# EAGLE design Arduino_uno_plus_EthernetShield_withExptenderPCF8574 (EAGLE 7.6.0)
Schematic for ARDUINO UNO with Eternet shield and Extender PCF8574N
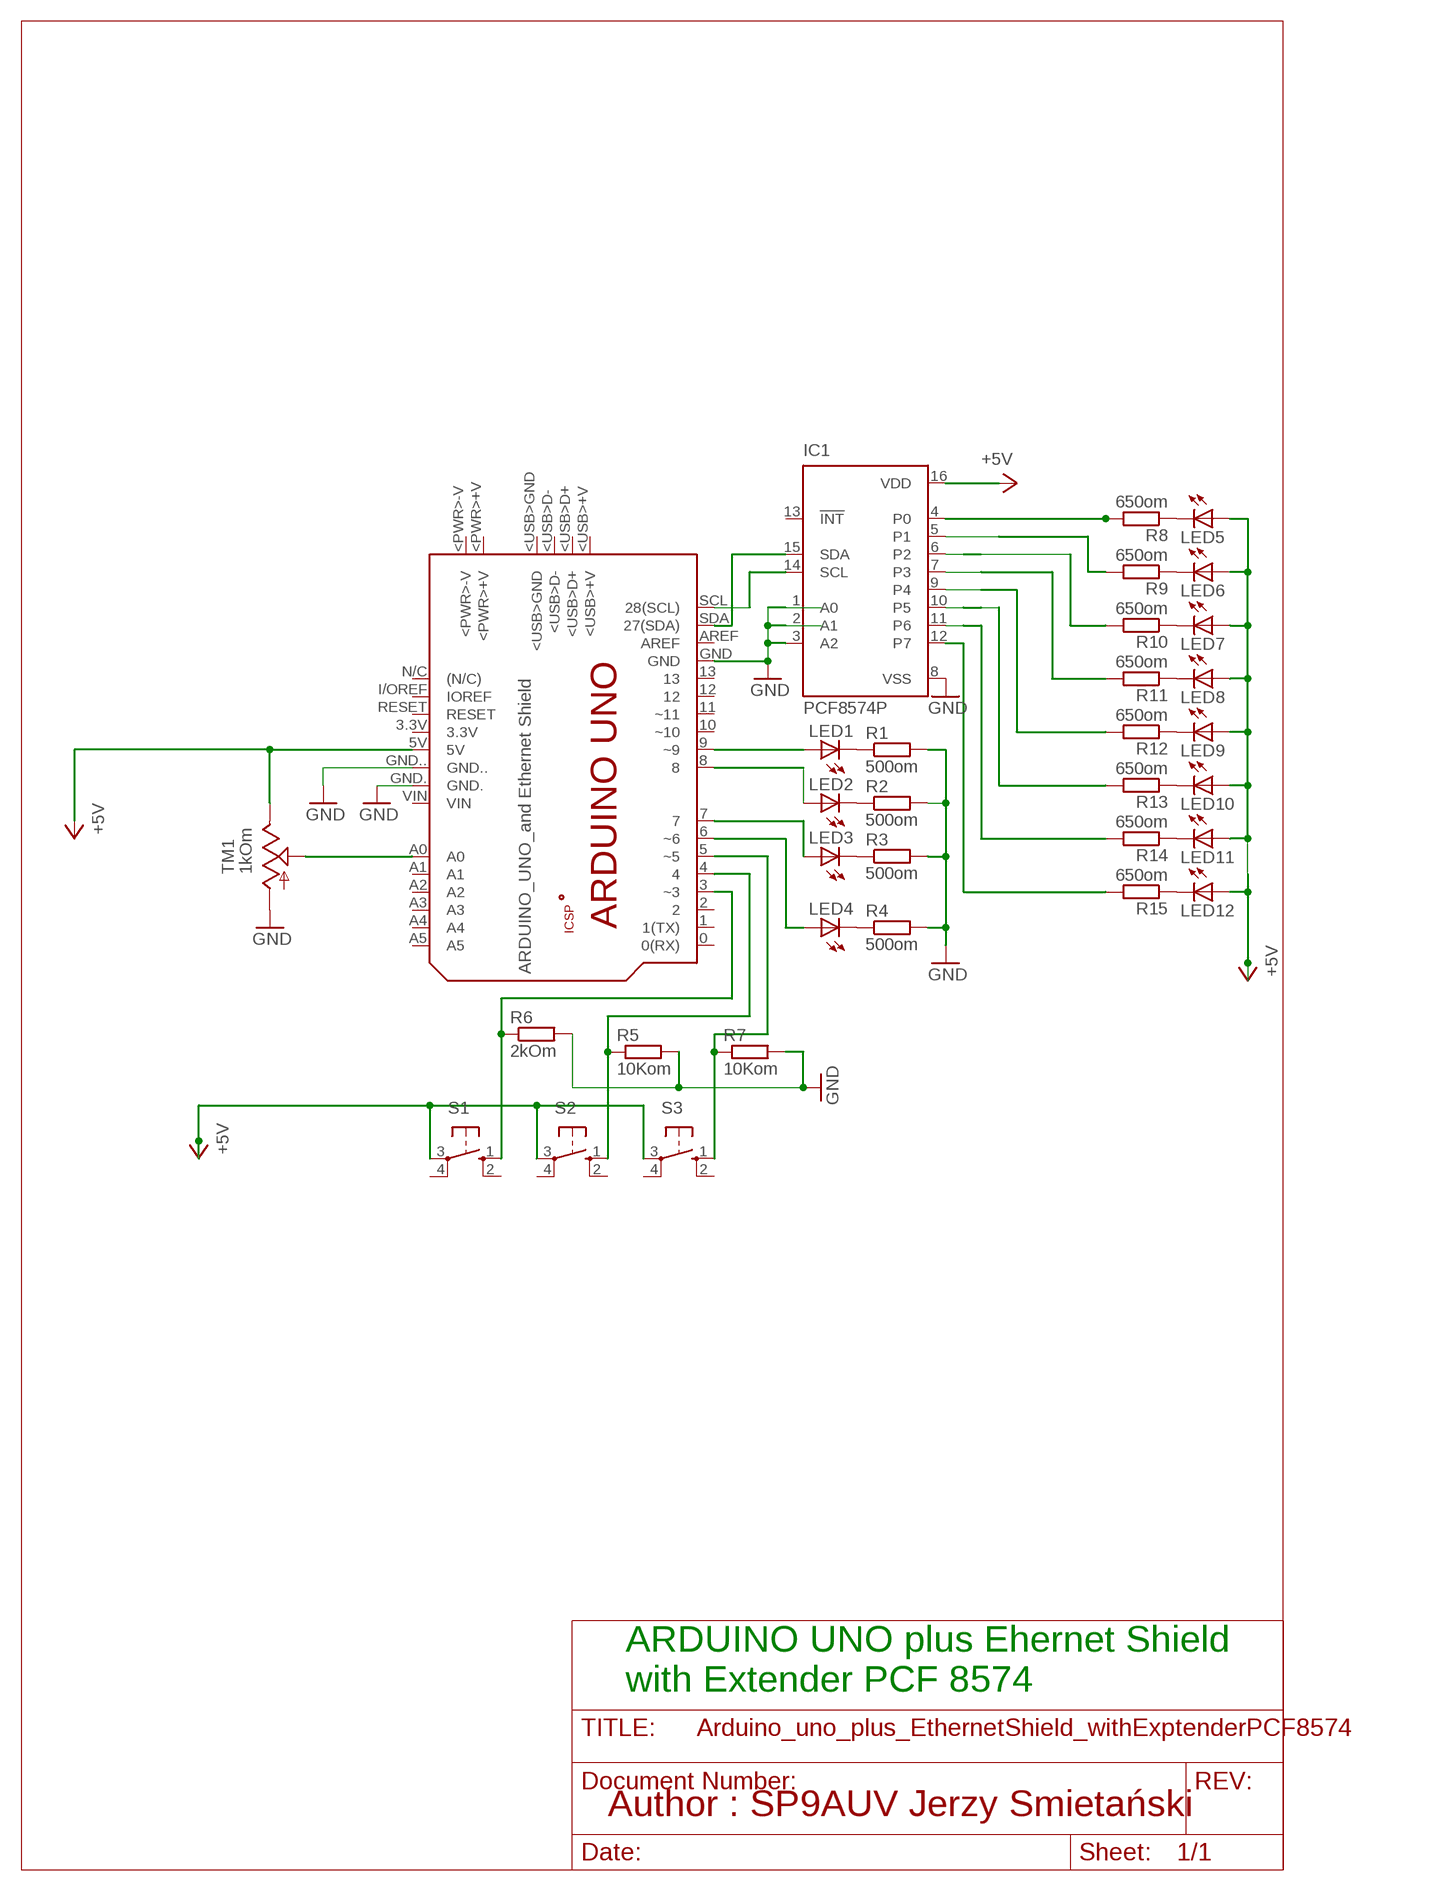
[diagram p0: schematic, sheet 1]

## Parts
ARDUINO_UNO  ARDUINO_U1  ARDUINO_UNO  [ARDUINO_UNO]
IC1  PCF8574P  [DIL16]
LED1  LEDSQR2X5  [LED2X5]
LED2  LEDSQR2X5  [LED2X5]
LED3  LEDSQR2X5  [LED2X5]
LED4  LEDSQR2X5  [LED2X5]
LED5  LEDSQR2X5  [LED2X5]
LED6  LEDSQR2X5  [LED2X5]
LED7  LEDSQR2X5  [LED2X5]
LED8  LEDSQR2X5  [LED2X5]
LED9  LEDSQR2X5  [LED2X5]
LED10  LEDSQR2X5  [LED2X5]
LED11  LEDSQR2X5  [LED2X5]
LED12  LEDSQR2X5  [LED2X5]
R1  500om  R-EU_0204/5  [0204/5]
R2  500om  R-EU_0204/5  [0204/5]
R3  500om  R-EU_0204/5  [0204/5]
R4  500om  R-EU_0204/5  [0204/5]
R5  10Kom  R-EU_0204/5  [0204/5]
R6  2kOm  R-EU_0204/5  [0204/5]
R7  10Kom  R-EU_0204/5  [0204/5]
R8  650om  R-EU_0204/5  [0204/5]
R9  650om  R-EU_0204/5  [0204/5]
R10  650om  R-EU_0204/5  [0204/5]
R11  650om  R-EU_0204/5  [0204/5]
R12  650om  R-EU_0204/5  [0204/5]
R13  650om  R-EU_0204/5  [0204/5]
R14  650om  R-EU_0204/5  [0204/5]
R15  650om  R-EU_0204/5  [0204/5]
S1  10-XX  [B3F-10XX]
S2  10-XX  [B3F-10XX]
S3  10-XX  [B3F-10XX]
TM1  1kOm  TRIM  [6MM]

## Nets
+5V: ARDUINO_UNO.5V IC1.16(VDD) LED5.A LED6.A LED7.A LED8.A LED9.A LED10.A LED11.A LED12.A S1.3(P) S2.3(P) S3.3(P) TM1.E
GND: ARDUINO_UNO.GND ARDUINO_UNO.GND.. IC1.2(A1) IC1.3(A2) IC1.8(VSS) R1.2 R2.2 R3.2 R4.2 R5.2 R6.2 R7.2
GND1: IC1.5(P1) R9.2
N$1: ARDUINO_UNO.A0 TM1.S
N$3: ARDUINO_UNO.GND. TM1.A ; supply symbol labelled GND
N$4: LED1.K(C) R1.1
N$5: LED2.K(C) R2.1
N$6: LED3.K(C) R3.1
N$7: LED4.K(C) R4.1
N$8: ARDUINO_UNO.9(~9) LED1.A
N$9: ARDUINO_UNO.8 LED2.A
N$10: ARDUINO_UNO.7 LED3.A
N$11: ARDUINO_UNO.3(~3) R6.1 S1.1(S)
N$12: ARDUINO_UNO.6(~6) LED4.A
N$13: ARDUINO_UNO.5(~5) R7.1 S3.1(S)
N$14: IC1.1(A0)
N$15: ARDUINO_UNO.4 R5.1 S2.1(S)
N$16: IC1.12(P7) R15.2
N$17: IC1.7(P3) R11.2
N$18: IC1.6(P2) R10.2
N$19: IC1.4(P0) R8.2
N$21: LED5.K(C) R8.1
N$22: LED6.K(C) R9.1
N$23: LED7.K(C) R10.1
N$24: LED8.K(C) R11.1
N$25: IC1.10(P5) R13.2
N$26: IC1.9(P4) R12.2
N$27: ARDUINO_UNO.SCL(28(SCL)) IC1.14(SCL)
N$28: ARDUINO_UNO.SDA(27(SDA)) IC1.15(SDA)
N$29: LED9.K(C) R12.1
N$32: LED10.K(C) R13.1
N$35: LED11.K(C) R14.1
N$36: IC1.11(P6) R14.2
N$38: LED12.K(C) R15.1
Unconnected: ARDUINO_UNO.0(0(RX)) ARDUINO_UNO.1(1(TX)) ARDUINO_UNO.2 ARDUINO_UNO.3.3V ARDUINO_UNO.10(~10) ARDUINO_UNO.11(~11) ARDUINO_UNO.12 ARDUINO_UNO.13 ARDUINO_UNO.+5V ARDUINO_UNO.<PWR>+V ARDUINO_UNO.<PWR>-V ARDUINO_UNO.<USB>+V ARDUINO_UNO.<USB>D+ ARDUINO_UNO.<USB>D- ARDUINO_UNO.<USB>GND ARDUINO_UNO.A1 ARDUINO_UNO.A2 ARDUINO_UNO.A3 ARDUINO_UNO.A4 ARDUINO_UNO.A5 ARDUINO_UNO.AREF ARDUINO_UNO.GND_ ARDUINO_UNO.I/OREF(IOREF) ARDUINO_UNO.MISO ARDUINO_UNO.MOSI ARDUINO_UNO.N/C((N/C)) ARDUINO_UNO.RESET ARDUINO_UNO.RESET. ARDUINO_UNO.SCK ARDUINO_UNO.VIN IC1.13(!INT) S1.2(S1) S1.4(P1) S2.2(S1) S2.4(P1) S3.2(S1) S3.4(P1)

## Notes on the sheet
- ARDUINO UNO plus Ehernet Shield 
  with Extender PCF 8574
- Author : SP9AUV Jerzy Smietański

## Library data of the parts
ARDUINO_UNO = E14_Arduino_revC:ARDUINO_UNO: Device for representing an Arduino Uno board with a footprint in an EAGLE design. Created by Dave Young for Element14. More EAGLE documentation at: http://www.element14.com/community/community/knode/cadsoft_eagle; ARDUINO_UNO_AND_ETHERNET: ARDUINO_UNO_and Ethernet Shield
IC1 = micro-philips:PCF8574: I2C-Bus Remote 8-bit I/O expander http://www.semiconductors.philips.com/acrobat_download/datasheets/PCF8574_4.pdf
LED1-LED12 = led:LED: LED OSRAM: - CHIPLED LG R971, LG N971, LY N971, LG Q971, LY Q971, LO R971, LY R971 LH N974, LH R974 LS Q976, LO Q976, LY Q976 LO Q996 - Hyper CHIPLED LW Q18S LB Q993, LB Q99A, LB R99A - SideLED LS A670, LO A670, LY A670, LG A670, LP A670 LB A673, LV A673, LT A673, LW A673 LH A674 LY A675 LS A676, LA A676, LO A676, LY A676, LW A676 LS A679, LY A679, LG A679 - Hyper Micro SIDELED® LS Y876, LA Y876, LO Y876, LY Y876 LT Y87S - SmartLED LW L88C, LW L88S LB L89C, LB L89S, LG L890 LS L89K, LO L89K, LY L89K LS L896, LA L896, LO L896, LY L896 - TOPLED LS T670, LO T670, LY T670, LG T670, LP T670 LSG T670, LSP T670, LSY T670, LOP T670, LYG T670 LG T671, LOG T671, LSG T671 LB T673, LV T673, LT T673, LW T673 LH T674 LS T676, LA T676, LO T676, LY T676, LB T676, LH T676, LSB T676, LW T676 LB T67C, LV T67C, LT T67C, LS T67K, LO T67K, LY T67K, LW E67C LS E67B, LA E67B, LO E67B, LY E67B, LB E67C, LV E67C, LT E67C LW T67C LS T679, LY T679, LG T679 LS T770, LO T770, LY T770, LG T770, LP T770 LB T773, LV T773, LT T773, LW T773 LH T774 LS E675, LA E675, LY E675, LS T675 LS T776, LA T776, LO T776, LY T776, LB T776 LHGB T686 LT T68C, LB T68C - Hyper Mini TOPLED® LB M676 - Mini TOPLED Santana® LG M470 LS M47K, LO M47K, LY M47K Source: http://www.osram.convergy.de LUXEON: - LUMILED® LXK2-PW12-R00, LXK2-PW12-S00, LXK2-PW14-U00, LXK2-PW14-V00 LXK2-PM12-R00, LXK2-PM12-S00, LXK2-PM14-U00 LXK2-PE12-Q00, LXK2-PE12-R00, LXK2-PE12-S00, LXK2-PE14-T00, LXK2-PE14-U00 LXK2-PB12-K00, LXK2-PB12-L00, LXK2-PB12-M00, LXK2-PB14-N00, LXK2-PB14-P00, LXK2-PB14-Q00 LXK2-PR12-L00, LXK2-PR12-M00, LXK2-PR14-Q00, LXK2-PR14-R00 LXK2-PD12-Q00, LXK2-PD12-R00, LXK2-PD12-S00 LXK2-PH12-R00, LXK2-PH12-S00 LXK2-PL12-P00, LXK2-PL12-Q00, LXK2-PL12-R00 Source: www.luxeon.com KINGBRIGHT: KA-3528ASYC Source: www.kingbright.com
R1-R15 = rcl:R-EU_: RESISTOR, European symbol
S1-S3 = switch-omron:10-XX: OMRON SWITCH; MPN: B3F-1000; OC_FARNELL: 176432; OC_NEWARK: 36M3542
TM1 = adafruit:TRIM

## Board
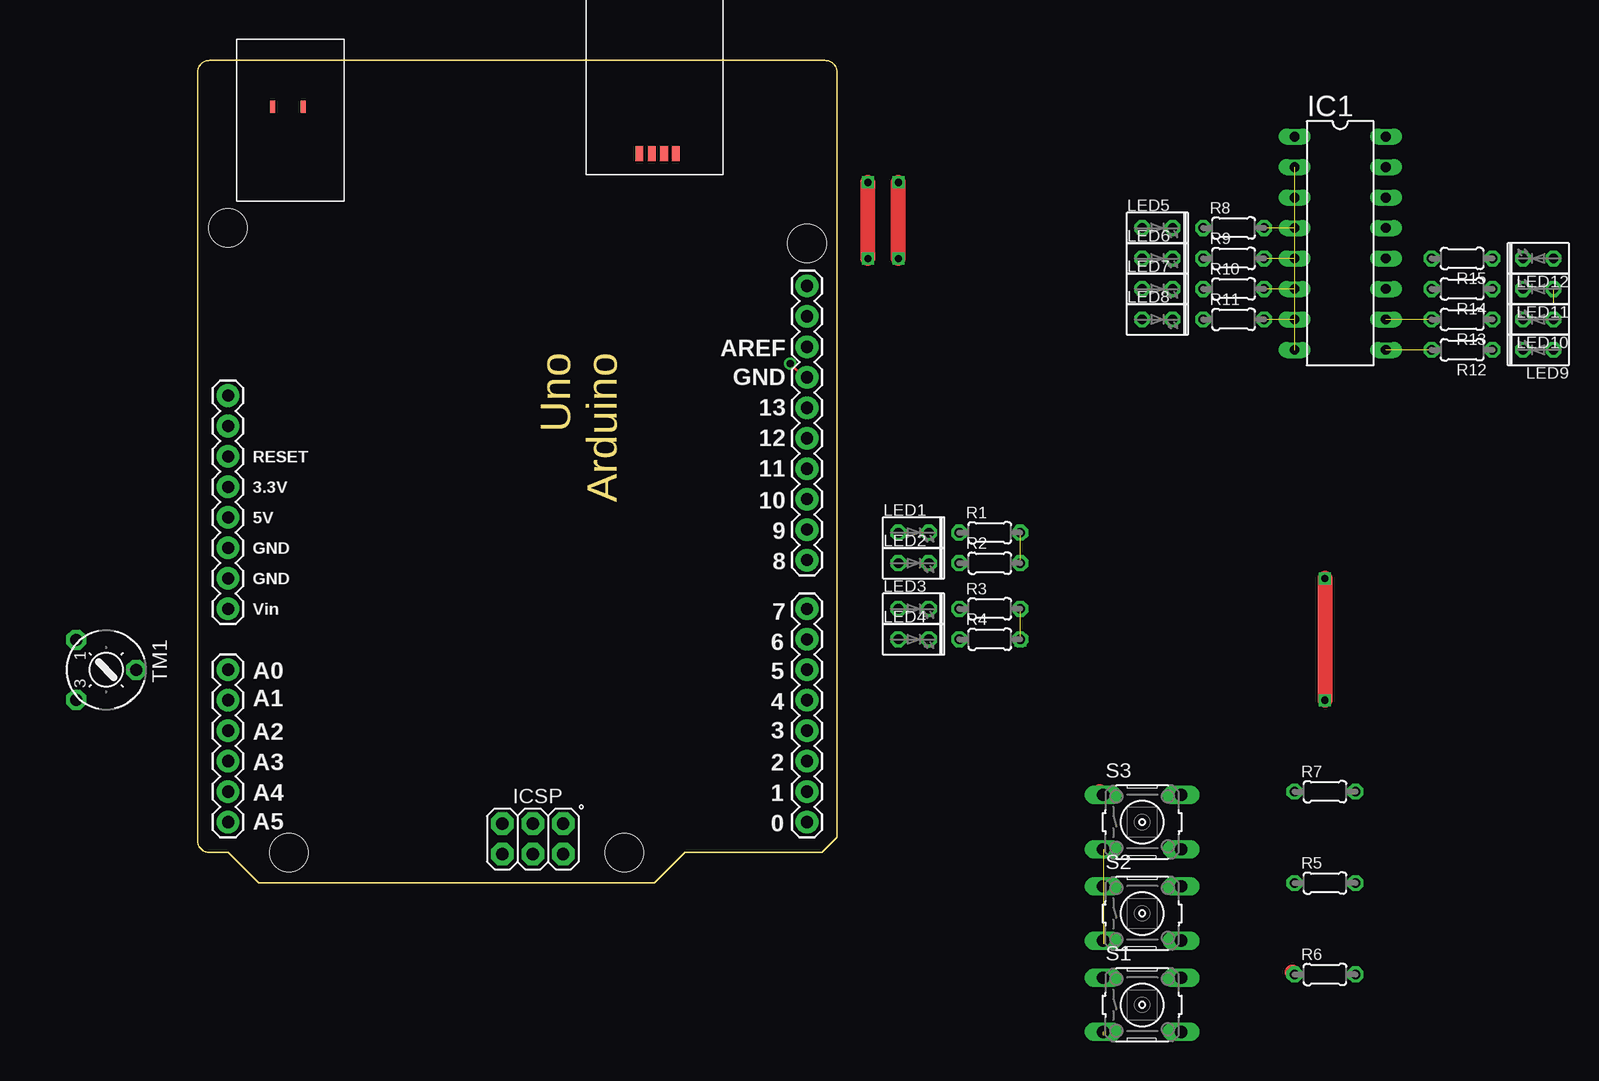
[diagram p1: board, top side]
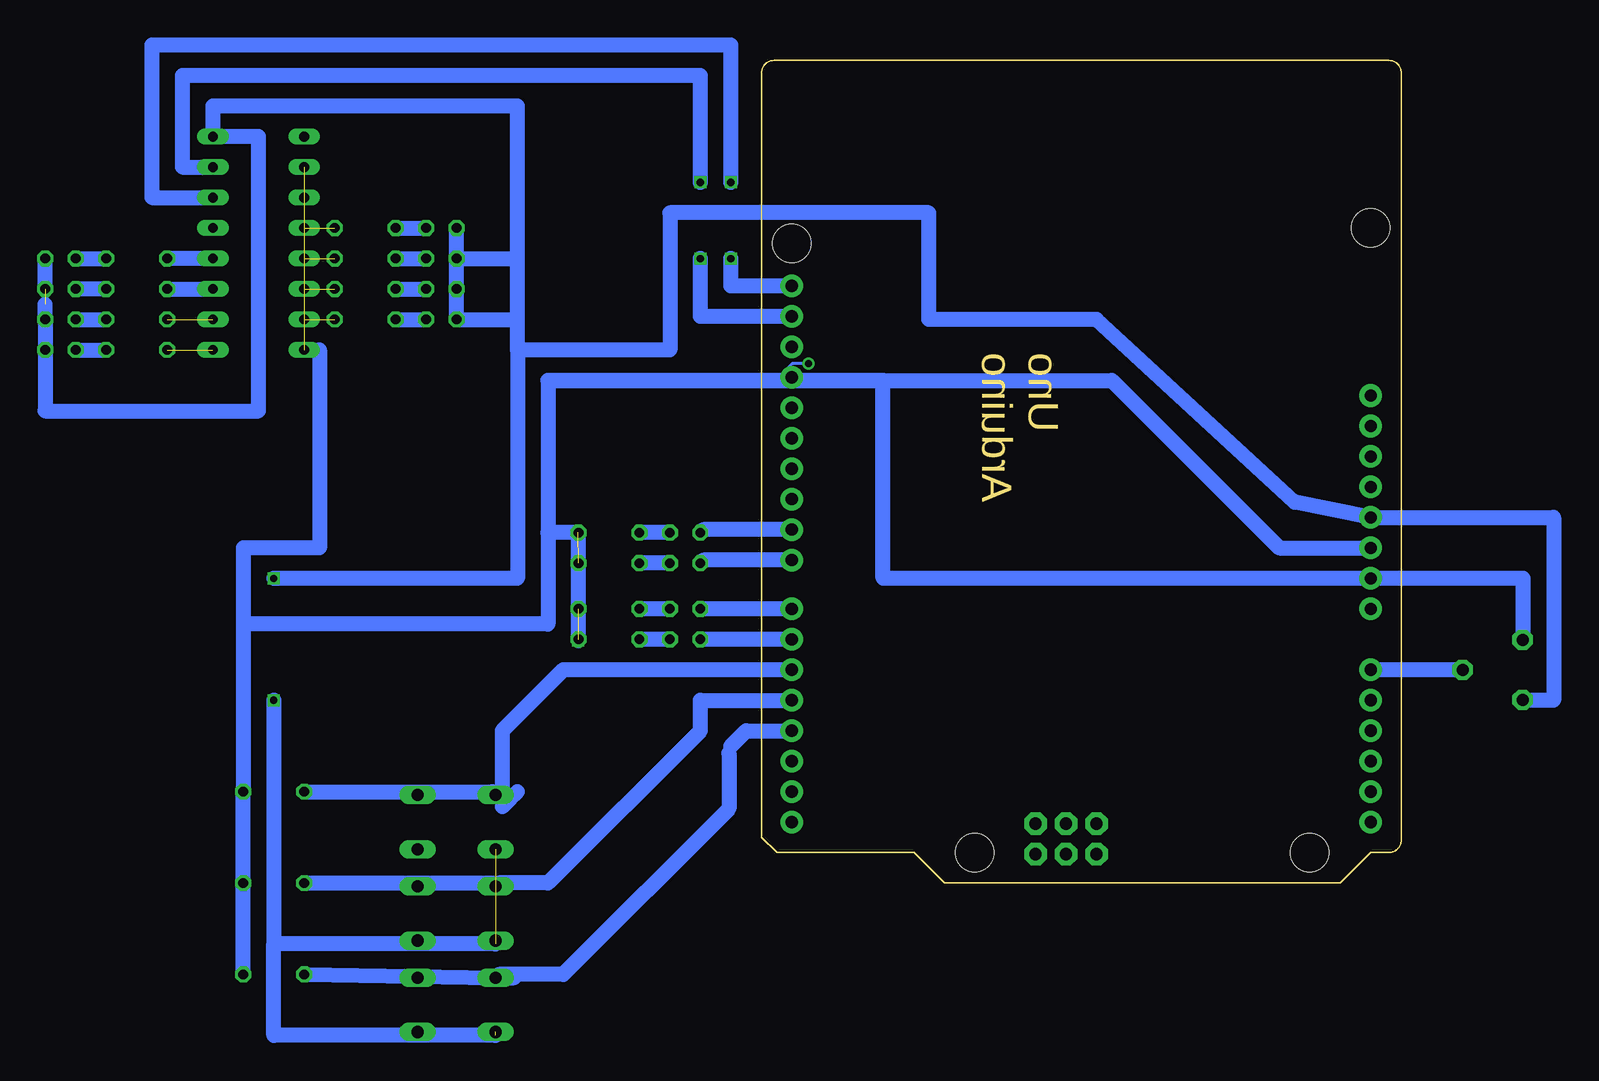
[diagram p2: board, bottom side, seen from below]

Size 53.31 x 68.58 mm. Coordinates in mm from the lower left corner, seen from the top.
Copper layers (1*16): Top 0.035mm / dielectric 1.5mm / Bottom 0.035mm
Design rules "default": minimum track width 10mil, minimum drill 24mil, track to track 8mil, track to pad 8mil, pad to pad 8mil, via to via 8mil, smd to smd 8mil, copper to edge 40mil, drill to drill 8mil, minimum pad ring 10mil, minimum via ring 8mil, stop-mask expansion 4mil, vias tented up to drill 0mil, thermal gap 10mil

### Footprints (pad centres in the part's own frame; a part is rotated, then mirrored left to right if it is on the bottom)
ARDUINO_UNO = drill 1.016 pad 1.88: 0 63.5,50.8; 1 60.96,50.8; 2 58.42,50.8; 3 55.88,50.8; 3.3V 35.56,2.54; 4 53.34,50.8; 5 50.8,50.8; 5V 38.1,2.54; 6 48.26,50.8; 7 45.72,50.8; 8 41.656,50.8; 9 39.116,50.8; 10 36.576,50.8; 11 34.036,50.8; 12 31.496,50.8; 13 28.956,50.8; A0 50.8,2.54; A1 53.34,2.54; A2 55.88,2.54; A3 58.42,2.54; A4 60.96,2.54; A5 63.5,2.54; AREF 23.876,50.8; GND 26.416,50.8; GND. 43.18,2.54; GND.. 40.64,2.54; I/OREF 30.48,2.54; N/C 27.94,2.54; RESET 33.02,2.54; SCL 18.796,50.8; SDA 21.336,50.8; VIN 45.72,2.54 | drill 1.016 pad 1.88 octagon: +5V 66.167,30.48; GND_ 66.167,25.4; MISO 63.627,30.48; MOSI 66.167,27.94; RESET. 63.627,25.4; SCK 63.627,27.94 | smd 1.016 x 0.508: <PWR>+V 3.861,8.814; <PWR>-V 3.861,6.274 | smd 1.27 x 0.635: <USB>+V 7.772,39.878; <USB>D+ 7.772,38.887; <USB>D- 7.772,37.871; <USB>GND 7.772,36.83 | hole 3.2: 66.04,7.62; 66.04,35.56; 15.24,50.8; 13.97,2.54
DIL16 = drill 0.813 long: 1 -8.89,-3.81; 2 -6.35,-3.81; 3 -3.81,-3.81; 4 -1.27,-3.81; 5 1.27,-3.81; 6 3.81,-3.81; 7 6.35,-3.81; 8 8.89,-3.81; 9 8.89,3.81; 10 6.35,3.81; 11 3.81,3.81; 12 1.27,3.81; 13 -1.27,3.81; 14 -3.81,3.81; 15 -6.35,3.81; 16 -8.89,3.81
LED2X5 = drill 0.813 octagon: A -1.27,0; K 1.27,0
0204/5 = drill 0.813 octagon: 1 -2.54,0; 2 2.54,0
B3F-10XX = drill 1.016 long: 1 -3.251,2.261; 2 3.251,2.261; 3 -3.251,-2.261; 4 3.251,-2.261
6MM = drill 1 pad 1.676 octagon: A -2.5,-2.5; E 2.5,-2.5; S 0,2.5

### Placement (x,y rotation side)
ARDUINO_UNO  0,68.58 270 top
IC1  95.25,53.34 270 top  (outside the outline)
LED1  59.69,29.21 0 top  (outside the outline)
LED2  59.69,26.67 0 top  (outside the outline)
LED3  59.69,22.86 0 top  (outside the outline)
LED4  59.69,20.32 0 top  (outside the outline)
LED5  80.01,54.61 0 top  (outside the outline)
LED6  80.01,52.07 0 top  (outside the outline)
LED7  80.01,49.53 0 top  (outside the outline)
LED8  80.01,46.99 0 top  (outside the outline)
LED9  111.76,44.45 180 top  (outside the outline)
LED10  111.76,46.99 180 top  (outside the outline)
LED11  111.76,49.53 180 top  (outside the outline)
LED12  111.76,52.07 180 top  (outside the outline)
R1  66.04,29.21 0 top  (outside the outline)
R2  66.04,26.67 0 top  (outside the outline)
R3  66.04,22.86 0 top  (outside the outline)
R4  66.04,20.32 0 top  (outside the outline)
R5  93.98,0 0 top  (outside the outline)
R6  93.98,-7.62 0 top  (outside the outline)
R7  93.98,7.62 0 top  (outside the outline)
R8  86.36,54.61 0 top  (outside the outline)
R9  86.36,52.07 0 top  (outside the outline)
R10  86.36,49.53 0 top  (outside the outline)
R11  86.36,46.99 0 top  (outside the outline)
R12  105.41,44.45 180 top  (outside the outline)
R13  105.41,46.99 180 top  (outside the outline)
R14  105.41,49.53 180 top  (outside the outline)
R15  105.41,52.07 180 top  (outside the outline)
S1  78.74,-10.16 0 top  (outside the outline)
S2  78.74,-2.54 0 top  (outside the outline)
S3  78.74,5.08 0 top  (outside the outline)
TM1  -7.62,17.78 270 top  (outside the outline)

### Tracks (layer width: path | path; a pad name or v marks a point on that pad's centre or on a via)
+5V  (via drill 0.6)  (4 unrouted)
  Top 1.27: v93.98,25.4 v93.98,15.24
  Bottom 1.27: TM1.E -10.12,15.24 -12.7,15.24 -12.7,30.48 ARDUINO_UNO.5V 8.89,31.75 25.4,46.99 39.37,46.99 39.37,55.88 60.96,55.88 60.96,44.45 73.66,44.45 | v93.98,15.24 93.98,-5.08 | 75.49,-12.7 93.98,-12.7 93.98,-5.08 | 75.49,-5.08 93.98,-5.08 | 73.66,44.45 73.66,25.4 v93.98,25.4 | 73.66,44.45 73.66,46.99 | 73.66,46.99 73.66,64.77 99.06,64.77 IC1.16 95.25,62.23 95.25,39.37 113.03,39.37 LED10.A | LED6.A LED7.A LED8.A 73.66,46.99 | LED6.A LED5.A | LED11.A LED12.A | LED10.A 113.03,48.26 | LED10.A LED9.A | LED6.A 73.66,52.07
GND  (via drill 0.6, 0.61)  (4 unrouted)
  Top 0.254: v49.4,43.31 50.55,42.16 ARDUINO_UNO.GND | v68.61,20.22 R4.2
  Bottom 0.254: v49.4,43.31 50.77,43.31 51.69,42.39 51.69,41.91
  Bottom 1.27: ARDUINO_UNO.GND.. 10.16,27.94 24.13,41.91 51.69,41.91 71.12,41.91 71.12,29.21 | R6.2 R5.2 R7.2 96.52,21.59 | IC1.8 90.17,44.45 90.17,27.94 96.52,27.94 96.52,21.59 | v68.61,20.22 68.61,29.21 R1.2 71.12,29.21 | 71.12,29.21 71.12,21.59 96.52,21.59
GND1  (1 unrouted)
N$1
  Bottom 1.27: TM1.S ARDUINO_UNO.A0
N$3
  Bottom 0.254: TM1.A -10.03,20.45 -10.16,20.45
  Bottom 1.27: -10.16,20.32 -10.16,20.45 -10.16,25.4 ARDUINO_UNO.GND. 43.18,25.4 43.18,41.91 71.12,41.91
N$4
  Bottom 1.27: LED1.K R1.1
N$5
  Bottom 1.27: LED2.K R2.1
N$6
  Bottom 1.27: LED3.K R3.1
N$7
  Bottom 1.27: LED4.K R4.1
N$8
  Bottom 1.27: ARDUINO_UNO.9 58.17,29.46 LED1.A
N$9
  Bottom 1.27: ARDUINO_UNO.8 58.17,26.92 LED2.A
N$10
  Bottom 1.27: ARDUINO_UNO.7 LED3.A
N$11
  Top 0.254: 91.24,-7.44 R6.1
  Top 1.27: 91.24,-7.44 91.26,-7.44 R6.1
  Bottom 0.254: 56.03,10.85 55.88,11.43 | 69.52,-7.21 69.85,-7.62
  Bottom 1.27: S1.1 75.21,-7.62 69.85,-7.62 56.03,6.2 56.03,10.85 | S1.1 73.94,-7.9 | 55.88,11.43 54.61,12.7 ARDUINO_UNO.3 | R6.1 S1.1
N$12
  Bottom 1.27: ARDUINO_UNO.6 LED4.A
N$13
  Top 1.27: 75.21,7.62 S3.1
  Bottom 0.254: 74.32,6.96 74.55,7.19 S3.1 74.32,7.64 74.93,7.64
  Bottom 1.27: ARDUINO_UNO.5 69.85,17.78 74.93,12.7 74.93,7.64 74.93,7.62 | 73.66,7.62 74.32,6.96 74.93,6.35 | R7.1 75.77,7.62 S3.1
N$15
  Top 0.254: 91.64,-0.08 R5.1
  Bottom 1.27: ARDUINO_UNO.4 58.42,15.24 58.42,12.7 71.12,0 75.21,0 S2.1 75.77,0 R5.1
N$16
  Bottom 1.27: IC1.12 R15.2
N$17  (1 unrouted)
N$18  (1 unrouted)
N$19  (1 unrouted)
N$21
  Bottom 1.27: R8.1 LED5.K
N$22
  Bottom 1.27: R9.1 LED6.K
N$23
  Bottom 1.27: R10.1 LED7.K
N$24
  Bottom 1.27: R11.1 LED8.K
N$25  (1 unrouted)
N$26  (1 unrouted)
N$27  (via drill 0.6)
  Top 1.27: v55.88,52.07 v55.88,58.42
  Bottom 1.27: ARDUINO_UNO.SCL 55.88,49.78 v55.88,52.07 | IC1.14 104.14,57.15 104.14,69.85 55.88,69.85 v55.88,58.42
N$28  (via drill 0.6)
  Top 1.27: v58.42,52.07 v58.42,58.42
  Bottom 1.27: ARDUINO_UNO.SDA 58.42,47.24 v58.42,52.07 | IC1.15 101.6,59.69 101.6,67.31 58.42,67.31 v58.42,58.42
N$29
  Bottom 1.27: LED9.K R12.1
N$32
  Bottom 1.27: LED10.K R13.1
N$35
  Bottom 1.27: R14.1 LED11.K
N$36
  Bottom 1.27: R14.2 IC1.11
N$38
  Bottom 1.27: LED12.K R15.1